# Altium project 7953_IDC_TO_RS-50.PrjPcb
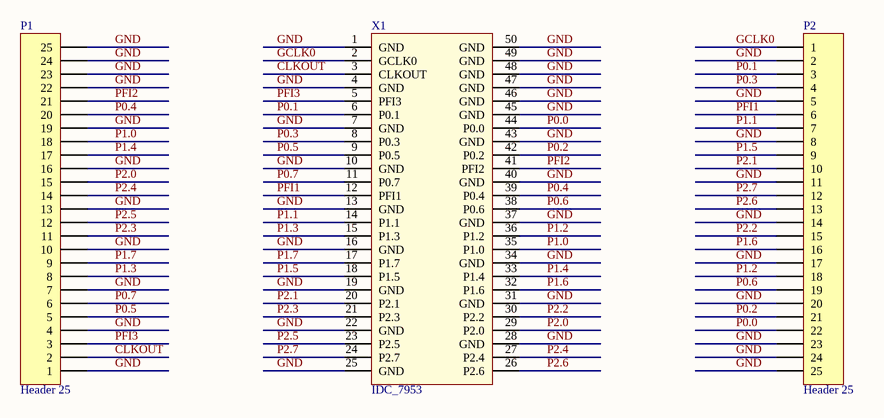
[diagram p0: 7953_IDC_TO_RS.SchDoc]
1 sheet, 3 parts. Net scope: global (net labels, ports and power ports of the same name join across sheets).
Board file: 7953_IDC_TO_RS.PcbDoc

## Sheet 7953_IDC_TO_RS.SchDoc
size A3; SheetNumber: 1; SheetTotal: 1

### Parts
P1  Header 25  [HDR1X25]
P2  Header 25  [HDR1X25]
X1  IDC_7953  [IDC_DIO]

### Nets
CLKOUT: P1.2 X1.3(CLKOUT)
GCLK0: P2.1 X1.2(GCLK0)
GND: P1.1 P1.4 P1.7 P1.10 P1.13 P1.16 P1.19 P1.22 P1.23 P1.24 P1.25 P2.2 P2.5 P2.8 P2.11 P2.14 P2.17 P2.20 P2.23 P2.24 P2.25 X1.1(GND) X1.4(GND) X1.7(GND) X1.10(GND) X1.13(GND) X1.16(GND) X1.19(GND) X1.22(GND) X1.25(GND) X1.28(GND) X1.31(GND) X1.34(GND) X1.37(GND) X1.40(GND) X1.43(GND) X1.45(GND) X1.46(GND) X1.47(GND) X1.48(GND) X1.49(GND) X1.50(GND)
P0.0: P2.22 X1.44(P0.0)
P0.1: P2.3 X1.6(P0.1)
P0.2: P2.21 X1.42(P0.2)
P0.3: P2.4 X1.8(P0.3)
P0.4: P1.20 X1.39(P0.4)
P0.5: P1.5 X1.9(P0.5)
P0.6: P2.19 X1.38(P0.6)
P0.7: P1.6 X1.11(P0.7)
P1.0: P1.18 X1.35(P1.0)
P1.1: P2.7 X1.14(P1.1)
P1.2: P2.18 X1.36(P1.2)
P1.3: P1.8 X1.15(P1.3)
P1.4: P1.17 X1.33(P1.4)
P1.5: P2.9 X1.18(P1.5)
P1.6: P2.16 X1.32(P1.6)
P1.7: P1.9 X1.17(P1.7)
P2.0: P1.15 X1.29(P2.0)
P2.1: P2.10 X1.20(P2.1)
P2.2: P2.15 X1.30(P2.2)
P2.3: P1.11 X1.21(P2.3)
P2.4: P1.14 X1.27(P2.4)
P2.5: P1.12 X1.23(P2.5)
P2.6: P2.13 X1.26(P2.6)
P2.7: P2.12 X1.24(P2.7)
PFI1: P2.6 X1.12(PFI1)
PFI2: P1.21 X1.41(PFI2)
PFI3: P1.3 X1.5(PFI3)

### Library data of the parts
P1 P2 = Header 25: Header, 25-Pin; LatestRevisionDate: 17-Jul-2002; LatestRevisionNote: Re-released for DXP Platform.; Publisher: Altium Limited